# Altium schematic sheet SW_PS_5V.SchDoc: 5V Power Supply
size A4; Author: Eladio Delgado Mingorance; CompanyName: bq - Mundo Reader; Organization: bq - Mundo Reader; Revision: 1.4; SheetNumber: 9; SheetTotal: 10
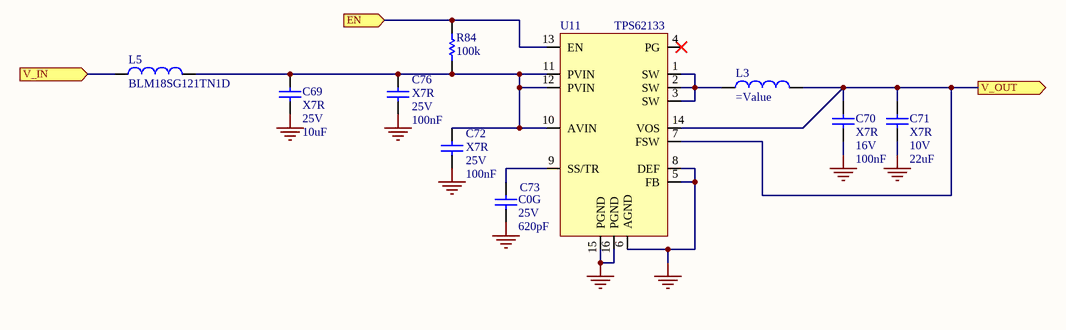
[diagram p0: SW_PS_5V.SchDoc]

## Parts
C69  Dielectric: X7R  Voltage: 25V  Capacitance: 10uF  [C1206]  (hidden comment: Capacitor)
C70  Dielectric: X7R  Voltage: 16V  Capacitance: 100nF  [C0603]  (hidden comment: Capacitor)
C71  Dielectric: X7R  Voltage: 10V  Capacitance: 22uF  [C1206]  (hidden comment: Capacitor)
C72  Dielectric: X7R  Voltage: 25V  Capacitance: 100nF  [C0603]  (hidden comment: Capacitor)
C73  Dielectric: C0G  Voltage: 25V  Capacitance: 620pF  [C0603]  (hidden comment: Capacitor)
C76  Dielectric: X7R  Voltage: 25V  Capacitance: 100nF  [C0603]  (hidden comment: Capacitor)
L3  (no value)  [TY_NRS6028]
L5  BLM18SG121TN1D  [L0603]
R84  100k  [R0603]
U11  TPS62133  [QFN16]

## Ports
EN (in), V_IN (in), V_OUT (out)

## Nets
GND: C69.1 C70.1 C71.1 C72.1 C73.1 C76.1 U11.5(FB) U11.6(AGND) U11.8(DEF) U11.15(PGND) U11.16(PGND)
EN: R84.2 U11.13(EN) ; port EN
V_IN: L5.1 ; port V_IN
V_OUT: C70.2 C71.2 L3.2 U11.7(FSW) U11.14(VOS) ; port V_OUT
NetC69_2: C69.2 C72.2 C76.2 L5.2 R84.1 U11.10(AVIN) U11.11(PVIN) U11.12(PVIN)
NetC73_2: C73.2 U11.9(SS/TR)
NetL3_1: L3.1 U11.1(SW) U11.2(SW) U11.3(SW)

Not connected (* = marked no-connect by the designer): U11 4(PG)*

## Notes on the sheet
- Title
- Project
- Size:
- Author
- A4
- Number:
- Revision:
- Mundo Reader, S.L. This project and all the sheets and layouts enclosed are licensed under Creative Commons by Attribution and Share Alike [CC BY-SA] (www.creativecommons.com)
- Date:
- Time:
- Sheet
- of

## Library data of the parts
C69 = C1206_10uF_25V_±10%: Capacitor SMD; Manufacturer: Taiyo Yuden; Value: 10uF ±10% 25V; Tolerance: ±10%; OrderingCode: TMK316B7106KL-TD; Temp_ Max: 125; Temp_ Min: -55; Part Number: C1206_10uF_25V_±10%; Price (€): 0,066
C70 = C0603_100nF_16V_±10%: Manufacturer: Kemet; Value: 100nF ±10% 16V; Tolerance: ±10%; OrderingCode: C0603C104K4RAC; Temp_ Max: 125; Temp_ Min: -55; Part Number: C0603_100nF_16V_±10%; Price (€): 0,012
C71 = C1206_22uF_10V_±10%: Manufacturer: Taiyo Yuden; Value: 22uF ±10% 10V; Tolerance: ±10%; OrderingCode: LMK316AB7226KL-TR; Temp_ Max: 125; Temp_ Min: -55; Part Number: C1206_22uF_10V_±10%; Price (€): 0,163
C72 C76 = C0603_100nF_25V_±10%: Manufacturer: Kemet; Value: 100nF ±10% 25V; Tolerance: ±10%; OrderingCode: C0603C104K3RAC; Temp_ Max: 125; Temp_ Min: -55; Part Number: C0603_100nF_25V_±10%; Price (€): 0,035
C73 = C0603_620pF_25V_±5%: Manufacturer: Murata; Value: 620pF ±5% 25V; Tolerance: ±5%; OrderingCode: GRM1885C1E621JA01D; Temp_ Max: 125; Temp_ Min: -55; Part Number: C0603_620pF_25V_±5%; Price (€): 0,023
L3 = 2,2uH_3,7A: Manufacturer: Taiyo Yuden; L: 2,2uH; Current: 3,7A; Current Sat#: 4,2A; OrderingCode: NRS6028T2R2NMGJV; Temp_ Max: 125; Temp_ Min: -40; Value: 2,2uH 3,7A; Part Number: 2,2uH_3,7A; Price (€): 0,17
L5 = L0603_120R_0,025R_3000mA: Ferrite Bead; Manufacturer: Murata; Resistance_100MHz: 120R; Resistance_DC: 0,025R; Current: 3000mA; Temp_ Max: 125; Temp_ Min: -55; Value: 120R 0,025R 3000mA; Part Number: L0603_120R_0,025R_3000mA; OrderingCode: BLM18SG121TN1D; Price (€): 0,053
R84 = R0603_100k_0.1W_±5%: Resistor; Manufacturer: Vishay; Tolerance: ±5%; OrderingCode: CRCW0603100KJN; Power: 0.1W; Value: 100k ±5% 0.1W; Temp_ Max: 155; Temp_ Min: -55; PackageDescription: SMD; Part Number: R0603_100k_0.1W_±5%; Resistance: 100k; Price (€): 0,003
U11 = TPS62133: 3A High Efficient Synchronous Step Down Converter with DCS™ Control; Manufacturer: Texas Instruments; Voltage IN: 3÷17 VDC; Voltage OUT: 0,9÷6 VDC; OrderingCode: TPS62133RGTR; Temp_ Max: 85; Temp_ Min: -40; Part Number: TPS62133; Current OUT: 3A; Supplier: Silica; Price (€): 1,5